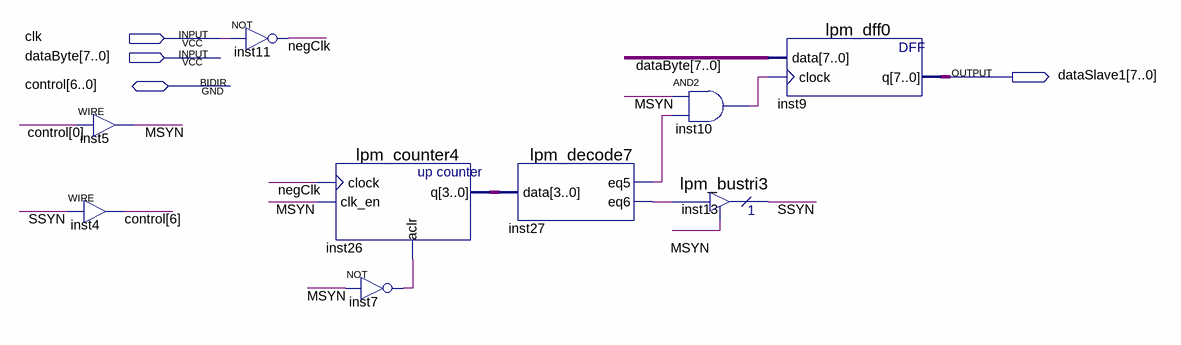
[diagram p0: schematic sheet]
// Quartus schematic Slave1.bdf as structural Verilog: 9 symbols, 4 pins
module Slave1 (
  input  clk,
  input  [7:0] dataByte,
  inout  [6:0] control,
  output [7:0] dataSlave1
);

  wire inst7_out, inst10_out, inst27_eq5, inst27_eq6, MSYN, negClk, SSYN;
  wire [3:0] inst26_q;

  assign control[6] = SSYN;  // WIRE inst4
  assign MSYN = control[0];  // WIRE inst5
  not inst11 (negClk, clk);
  lpm_counter4 inst26 (.clock(negClk), .clk_en(MSYN), .aclr(inst7_out), .q(inst26_q));
  not inst7 (inst7_out, MSYN);
  lpm_decode7 inst27 (.data(inst26_q), .eq5(inst27_eq5), .eq6(inst27_eq6));
  and inst10 (inst10_out, MSYN, inst27_eq5);
  lpm_bustri3 inst13 (.enabledt(MSYN), .data(inst27_eq6), .tridata(SSYN));
  lpm_dff0 inst9 (.data(dataByte), .clock(inst10_out), .q(dataSlave1));
endmodule
